# Altium schematic sheet CANbus.SchDoc
size A4
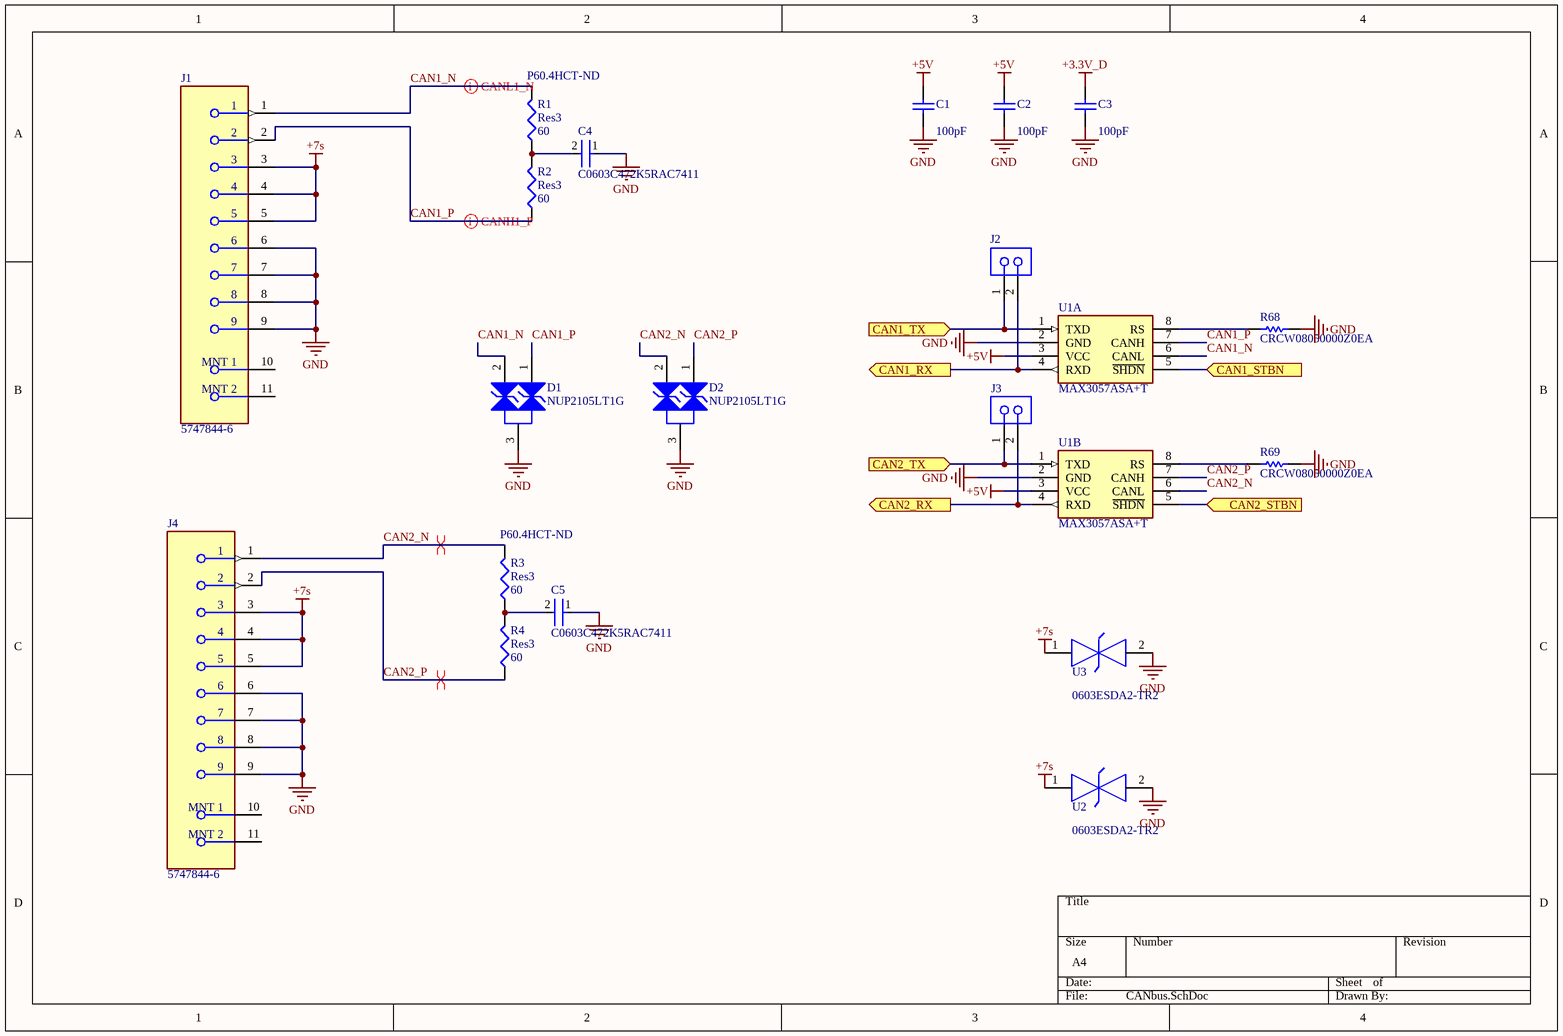
[diagram p0: CANbus.SchDoc]

## Parts
C1  value 100pF  [CAPC1608X90X35NL10T15]  (hidden comment: GRM1885C1H101JA01D)
C2  value 100pF  [CAPC1608X90X35NL10T15]  (hidden comment: GRM1885C1H101JA01D)
C3  value 100pF  [CAPC1608X90X35NL10T15]  (hidden comment: GRM1885C1H101JA01D)
C4  C0603C472K5RAC7411  [FP-C0603C-CF-MFG]
C5  C0603C472K5RAC7411  [FP-C0603C-CF-MFG]
D1  NUP2105LT1G  [ONSC-SOT-23-3-318-08_V]
D2  NUP2105LT1G  [ONSC-SOT-23-3-318-08_V]
J1  5747844-6  [FP-5747844-6-MFG]
J2  SSW-102-02-T-S  [SMTC-SSW-102-02-X-S]  (value not drawn)
J3  SSW-102-02-T-S  [SMTC-SSW-102-02-X-S]  (value not drawn)
J4  5747844-6  [FP-5747844-6-MFG]
R1  Res3  value 60  Supplier Part Number 1: P60.4HCT-ND  [J1-0603]
R2  Res3  value 60  [J1-0603]
R3  Res3  value 60  Supplier Part Number 1: P60.4HCT-ND  [J1-0603]
R4  Res3  value 60  [J1-0603]
R68  CRCW08050000Z0EA  [RESC2013X50X30LL20T20]
R69  CRCW08050000Z0EA  [RESC2013X50X30LL20T20]
U1A  MAX3057ASA+T  [SOIC127P600X175-8N]
U1B  MAX3057ASA+T  [SOIC127P600X175-8N]
U2  0603ESDA2-TR2  [Eaton_0603ESDA_0]  (value not drawn)
U3  0603ESDA2-TR2  [Eaton_0603ESDA_0]  (value not drawn)

## Ports
CAN1_RX (out), CAN1_STBN (in), CAN1_TX (in), CAN2_RX (out), CAN2_STBN (in), CAN2_TX (in)

## Nets
+3.3V_D: C3.2
+5V: C1.2 C2.2 U1A.3(VCC) U1B.3(VCC)
+7s: J1.3 J1.4 J1.5 J4.3 J4.4 J4.5 U2.1 U3.1
GND: C1.1 C2.1 C3.1 C4.1 C5.1 D1.3(K) D2.3(K) J1.6 J1.7 J1.8 J1.9 J4.6 J4.7 J4.8 J4.9 R68.2 R69.2 U1A.2(GND) U1B.2(GND) U2.2 U3.2
CAN1_N: D1.2(K) J1.1 R1.2 U1A.6(CANL)
CAN1_P: D1.1(K) J1.2 R2.1 U1A.7(CANH)
CAN1_RX: J2.2 U1A.4(RXD) ; port CAN1_RX
CAN1_STBN: U1A.5(~{SHDN}) ; port CAN1_STBN
CAN1_TX: J2.1 U1A.1(TXD) ; port CAN1_TX
CAN2_N: D2.2(K) J4.1 R3.2 U1B.6(CANL)
CAN2_P: D2.1(K) J4.2 R4.1 U1B.7(CANH)
CAN2_RX: J3.2 U1B.4(RXD) ; port CAN2_RX
CAN2_STBN: U1B.5(~{SHDN}) ; port CAN2_STBN
CAN2_TX: J3.1 U1B.1(TXD) ; port CAN2_TX
NetC4_2: C4.2 R1.1 R2.2
NetC5_2: C5.2 R3.1 R4.2
NetR68_1: R68.1 U1A.8(RS)
NetR69_1: R69.1 U1B.8(RS)

Not connected (* = marked no-connect by the designer): J1 10(MNT_1) 11(MNT_2); J4 10(MNT_1) 11(MNT_2)

## Layout directives
differential pair: CAN1_N, CAN1_P, CAN2_N, CAN2_P

## Library data of the parts
C1-C3 = CMP-2006-02595-1: Manufacturer: Murata; Part Number: GRM1885C1H101JA01D
C4 C5 = CMP-03020-003188-1: C0603 4,700 pF X7R 30ppm/°C 10.00% 50 V; Manufacturer: KEMET; Automotive Grade: Grade 1; Voltage Rating: 50 V; Material: Ceramic; Tolerance: 0.1; Capacitance: 4,700 pF; Manufacturer Part Number: C0603C472K5RAC7411; ComponentLink2URL: https://api.kemet.com/component-edge/download/datasheet/C0603C100J5GACAUTO.pdf; Value: 4,700 pF; RoHS: TRUE; Automotive: Yes; Package: C0603C-CF; Device Class L1: Passive Components; Temperature Coefficient: 30ppm/°C; Octopart: https://octopart.com/c0603c472k5rac7411-kemet-3746251; Temperature Range Low: -55°C; Height: 0.87mm; Device Class L2: Capacitors; Lead Free: Yes; ComponentLink2Description: Datasheet; Temperature: -55°C to +125°C; Temperature Range High: +125°C; Temperature Characteristic: X7R; Device Class L3: Ceramic Capacitors; Category: Cap
D1 D2 = CMP-1063-00164-1: Dual Line CAN Bus Protector, 3-Pin SOT-23, Pb-Free, Tape and Reel; Manufacturer: On Semiconductor; IR Max (uA): 0.1; Number of Lines: 2; Direction: Bidirectional; C Max (pF): 30; PPK Max (W): 350; V(BR) Min (V): 26.2; ComponentLink3URL: http://www.onsemi.cn/pub_link/Collateral/318-08.PDF; Mounting Technology: Surface Mount; ComponentLink2Description: Datasheet; PartNumber: NUP2105LT1G; ComponentLink1URL: http://www.onsemi.com/; PackageVersion: Rev. AP, 11/2009; DatasheetVersion: Rev. 5; RoHS: Pb-Free; PackageReference: SOT-23-3-318-08; ComponentLink2URL: http://www.onsemi.cn/pub_link/Collateral/NUP2105L-D.PDF; ComponentLink1Description: Manufacturer URL; PackageDescription: 3-Pin Small Outline Transistor, Body 2.92 x 1.3 mm, Pitch 0.95 mm; Packing: Tape and Reel; ComponentLink3Description: Package Specification
J1 J4 = CMP-2000-07496-2: CONN D-SUB RCPT 9POS R/A SOLDER; Manufacturer: TE Connectivity; Conn Gender: Female; Pitch: 2.74mm; Is Female: yes; Ciiva Ids: 587108; Current Rating: 6A; Conn Orientation: Right Angle; Number Of Contacts: 9; Import Ts: 1521841921; Shielding: true; ComponentLink2URL: https://www.te.com/commerce/DocumentDelivery/DDEController?Action=showdoc&DocId=Catalog+Section%7F82068_AMPLIMITE_Right-Angle_Posted_Conn%7F0412%7Fpdf%7FEnglish%7FENG_CS_82068_AMPLIMITE_Right-Angle_Posted_Conn_0412.pdf%7F5747844-6; Footprint Url: https://www.te.com/commerce/DocumentDelivery/DDEController?Action=showdoc&DocId=Customer+Drawing%7F5747844%7FP%7Fpdf%7FEnglish%7FENG_CD_5747844_P.pdf%7F5747844-6; ComponentLink2Description: Datasheet; Category: Conn; Height: 12.9286mm; RoHS: TRUE; Lead Free: Yes; Automotive: No; Octopart: https://octopart.com/5747844-6-te+connectivity-46505427; Package: 5747844-6; Release Date: 1508999366; Device Class L3: unset; Temperature Range High: +105°C; Contact Material: Gold,Tin; Digikey Description: CONN D-SUB RCPT 9POS R/A SOLDER; Device Class L1: Connectors; Device Class L2: D-Sub Connectors; Temperature Range Low: -55°C; Temperature: -55°C to +105°C; Mouser Description: D-Sub Standard Connectors 9 PIN RECEPTACLE; Manufacturer Part Number: 5747844-6
J2 J3 = CMP-1023-00323-1: SQ Post Socket, Through-hole, Vertical, -55 to 105 degC, 2.54 mm Pitch, 2-Pin, Female, RoHS; Manufacturer: Samtec; Pitch: 2.54 mm; ComponentLink3Description: Package Specification; ComponentLink2Description: Datasheet; ComponentLink1Description: Manufacturer URL; PackageVersion: CA, 6/1987; DatasheetVersion: F-214; PackageDescription: Assembly, Socket Strip .016 X .031 Tail; ComponentLink2URL: http://www.samtec.com/documents/webfiles/pdf/SSW_TH.PDF; RoHS: True; ComponentLink3URL: http://www.samtec.com/documents/webfiles/cpdf/SSW-1XX-XX-XXX-X-XX-XXX-XX-MKT.pdf; ComponentLink1URL: http://www.samtec.com; PackageReference: SSW-102-02-X-S; Mounting Technology: Through-hole; Orientation: Vertical; Temperature Range: -55 to 105 degC; PartNumber: SSW-102-02-T-S
R1-R4 = Res3: RESISTOR, 0603, 60R4 1%, 0.1W; Manufacturer: Panasonic; Manufacturer Part Number: ERJ-3EKF60R4V; Resistance: 60.4R; Power Rating: 100mW; Temperature Coefficient: 100ppm/°C; Voltage Rating: 75V; Voltage Rating (DC): 50V; Published: 8-Jun-2000; LatestRevisionDate: 29-May-2009; LatestRevisionNote: IPC-7351 Footprint Added.; PackageReference: J1-0603; Publisher: Altium Limited; PackageDescription: Chip Resistor; Supplier 1: Digi-Key; RoHS: Yes; Category: Chip SMD Resistors; Stock 1: 97677; Pricing 1: 1=0.10000, 10=0.05400, 100=0.02190, 1000=0.00983, 2500=0.00853 (USD); Mount: Surface Mount; Case/Package: 0603; Case Code (Metric): 1608; Case Code (Imperial): 0603; Contact Plating: Tin; Min Operating Temperature: -55°C; Max Operating Temperature: 155°C; Tolerance: 1%; Packaging: Tape and Reel; Composition: Thick Film; Number of Terminations: 2; Package Quantity: 1; Termination: SMD/SMT; Max Power Dissipation: 100mW; Military Standard: Not; Features: Automotive AEC-Q200; Length: 1.6mm; Height: 0.022inch; Width: 0.031inch; Depth: 0.8mm; REACH SVHC: No SVHC; Lead Free: Lead Free; ComponentLink1URL: https://datasheet.ciiva.com/28594/1678782-28594695.pdf?src-supplier=Element14; ComponentLink1Description: https://datasheet.ciiva.com/28594/1678782-28594695.pdf?src-supplier=Element14; ComponentLink2URL: https://datasheet.ciiva.com/30163/aoa0000ce2-30163208.pdf?src-supplier=Onlinecomponents.com; ComponentLink2Description: https://datasheet.ciiva.com/30163/aoa0000ce2-30163208.pdf?src-supplier=Onlinecomponents.com; ComponentLink3URL: https://datasheet.ciiva.com/5951/426256-5951371.pdf?src-supplier=Farnell; ComponentLink3Description: https://datasheet.ciiva.com/5951/426256-5951371.pdf?src-supplier=Farnell; ComponentLink4URL: https://datasheet.ciiva.com/16757/70260748-16757877.pdf?src-supplier=Allied+Electronics; ComponentLink4Description: https://datasheet.ciiva.com/16757/70260748-16757877.pdf?src-supplier=Allied+Electronics; ComponentLink5URL: https://datasheet.ciiva.com/24068/aoa0000ce2-24068761.pdf?src-supplier=Mouser; ComponentLink5Description: https://datasheet.ciiva.com/24068/aoa0000ce2-24068761.pdf?src-supplier=Mouser; ComponentLink6URL: https://datasheet.ciiva.com/16783/70260748-16783402.pdf?src-supplier=Allied+Electronics; ComponentLink6Description: https://datasheet.ciiva.com/16783/70260748-16783402.pdf?src-supplier=Allied+Electronics; ComponentLink7URL: https://datasheet.ciiva.com/28677/1678782-28677676.pdf?src-supplier=Element14; ComponentLink7Description: https://datasheet.ciiva.com/28677/1678782-28677676.pdf?src-supplier=Element14; ComponentLink8URL: https://datasheet.ciiva.com/43460/426256-43460428.pdf?src-supplier=Farnell; ComponentLink8Description: https://datasheet.ciiva.com/43460/426256-43460428.pdf?src-supplier=Farnell; ComponentLink9URL: https://datasheet.ciiva.com/46377/426256-46377437.pdf?src-supplier=Element14; ComponentLink9Description: https://datasheet.ciiva.com/46377/426256-46377437.pdf?src-supplier=Element14
  R2 R4: Supplier Part Number 1: P60.4HCT-ND
R68 R69 = CMP-2001-04896-1: Manufacturer: Vishay Dale; Part Number: CRCW08050000Z0EA
U1A U1B = MAX3057ASA+T: Integrated Circuit; Manufacturer_Name: Maxim Integrated; Datasheet Link: https://datasheets.maximintegrated.com/en/ds/MAX3050-MAX3057.pdf; Height: 1.75mm; Manufacturer_Part_Number: MAX3057ASA+T
U2 U3 = 0603ESDA2-TR2: DIODE SUPPRESSOR ESD 30VDC 0603 SMD; Manufacturer: Eaton; Capacitance: SKIP; Clamping Voltage: 35V; Direction: Bidirectional; Library Path1: parts/Diode_Eaton_0603ESDA2-TR2_eec.SchLib; Peak Pulse Current: 30A; Value: SKIP; Verification Version: 0.0.0.1; Part Number: 0603ESDA2-TR2; Datasheet Path: datasheets/Diode_Eaton_0603ESDA2-TR2_eec.pdf; ComponentLink1Description: Upverter; ComponentLink1URL: https://upverter.com/upn/revision/b9b7301627e297c3/; ComponentLink2Description: Datasheet; ComponentLink2URL: http://www.cooperindustries.com/content/dam/public/bussmann/Electronics/Resources/product-datasheets/bus-elx-ds-4419-0603esda2-tr2.pdf; Datasheet Path1: datasheets/Diode_Eaton_0603ESDA2-TR2_eec.pdf; Digikey Description: DIODE SUPPRESSOR ESD 30VDC 0603 SMD; Digikey Part Number: 283-4156-1-ND; Height: 0.7mm; Inductance: SKIP; Lead Free: yes; Library Ref1: 0603ESDA2-TR2; Mouser Description: MLP Series 60 V 0.1 pF Bi-Directional 0603 Surface Mount ESD Suppressor; Mouser Part Number: 504-0603ESDA2-TR2; Package: 0603ESDA; Price: 0.211194288872; Resistance: SKIP; RoHS: TRUE; Supplier 1: Digi-Key; Supplier 2: Mouser; Supplier Part Number 1: 283-4156-1-ND; Supplier Part Number 2: 504-0603ESDA2-TR2; Temperature: -55°C to +105°C; Temperature Range High: +105°C; Temperature Range Low: -55°C; Voltage: SKIP; helpURL: https://upverter.com/upn/revision/b9b7301627e297c3/